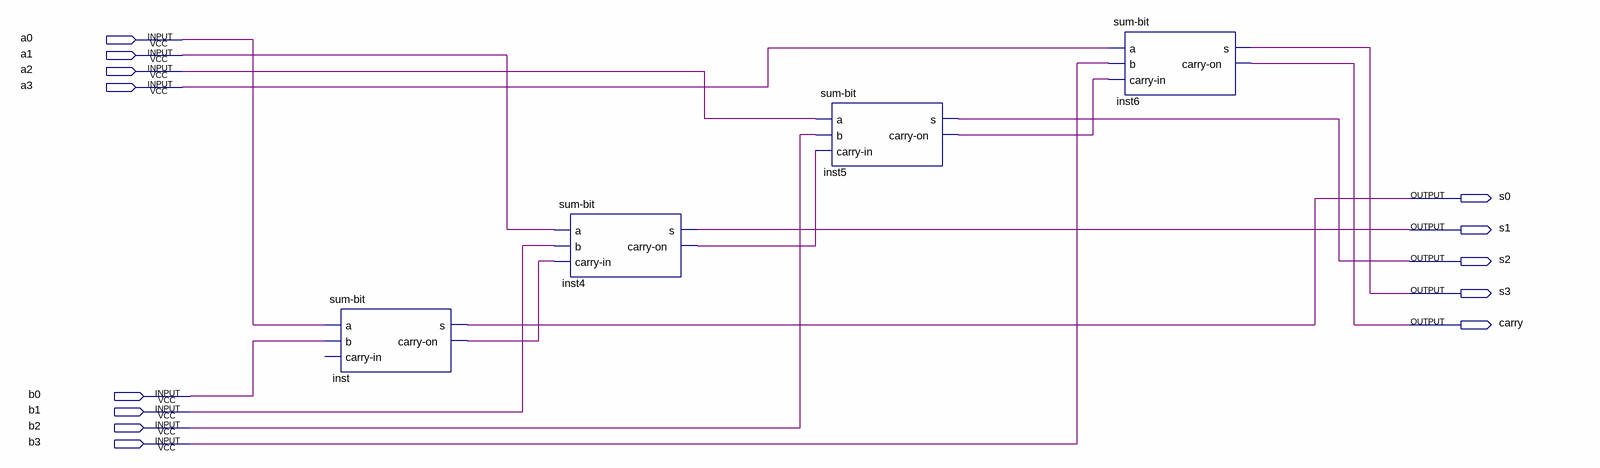
[diagram p0: schematic sheet]
// Quartus schematic sum-4-bit.bdf as structural Verilog: 4 symbols, 13 pins
module \sum-4-bit  (
  input  a0,
  input  a1,
  input  a2,
  input  a3,
  input  b0,
  input  b1,
  input  b2,
  input  b3,
  output s0,
  output s1,
  output s2,
  output s3,
  output carry
);

  wire inst4_carry_on, inst5_carry_on, inst_carry_on;

  \sum-bit  inst (.a(a0), .b(b0), .s(s0), .\carry-on (inst_carry_on));  // open: carry-in
  \sum-bit  inst4 (.a(a1), .b(b1), .\carry-in (inst_carry_on), .s(s1), .\carry-on (inst4_carry_on));
  \sum-bit  inst5 (.a(a2), .b(b2), .\carry-in (inst4_carry_on), .s(s2), .\carry-on (inst5_carry_on));
  \sum-bit  inst6 (.a(a3), .b(b3), .\carry-in (inst5_carry_on), .s(s3), .\carry-on (carry));
endmodule
